# EAGLE schematic Schema NE555 PWM (EAGLE 9.6.1)
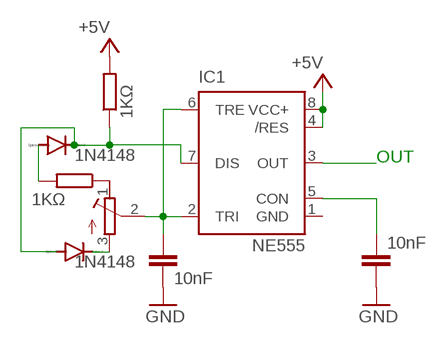
[diagram p0: schematic, sheet 1]

## Parts
C1  10nF  C2.5/2  [C2.5-2]
C2  10nF  C2.5/2  [C2.5-2]
D1  1N4148  1N4148DO35-7  [DO35-7]
D2  1N4148  1N4148DO35-7  [DO35-7]
IC1  NE555  [DIL-08]
R1  1KΩ  R-EU_0207/10  [0207/10]
R2  R-TRIMM43P  [RTRIM43P]
R3  1KΩ  R-EU_0207/10  [0207/10]

## Nets
GND: C1.2 C2.2
N$1: C1.1 IC1.5(CON)
N$2: IC1.3(OUT)
N$4: C2.1 IC1.2(TRI) IC1.6(TRE) R2.2(S)
N$5: R2.1(E) R3.1
N$6: D2.A R3.2
N$7: D1.C R2.3(A)
N$8: D1.A D2.C IC1.7(DIS) R1.1
VCC: IC1.4(/RES) IC1.8(VCC+) R1.2 ; supply symbol labelled +5V

## Notes on the sheet
- OUT

## Power pins joined to a net without a drawn wire
GND: IC1.1(GND)

## Library data of the parts
C1 C2 = capacitor-wima:C: CAPACITOR naming: grid - package width
D1 D2 = diode:1N4148: DIODE high speed (Philips)
IC1 = st-microelectronics:NE555: General purpose bipolar Timer; MF: Arrow Electronics; MPN: NE555N; OC_FARNELL: 1467742; OC_NEWARK: 89K1486
R1 R3 = rcl:R-EU_: RESISTOR, European symbol; SPICEPREFIX: R
R2 = rcl:R-TRIMM: Trimm resistor; SPICEMODEL: X; SPICEPREFIXL: POT